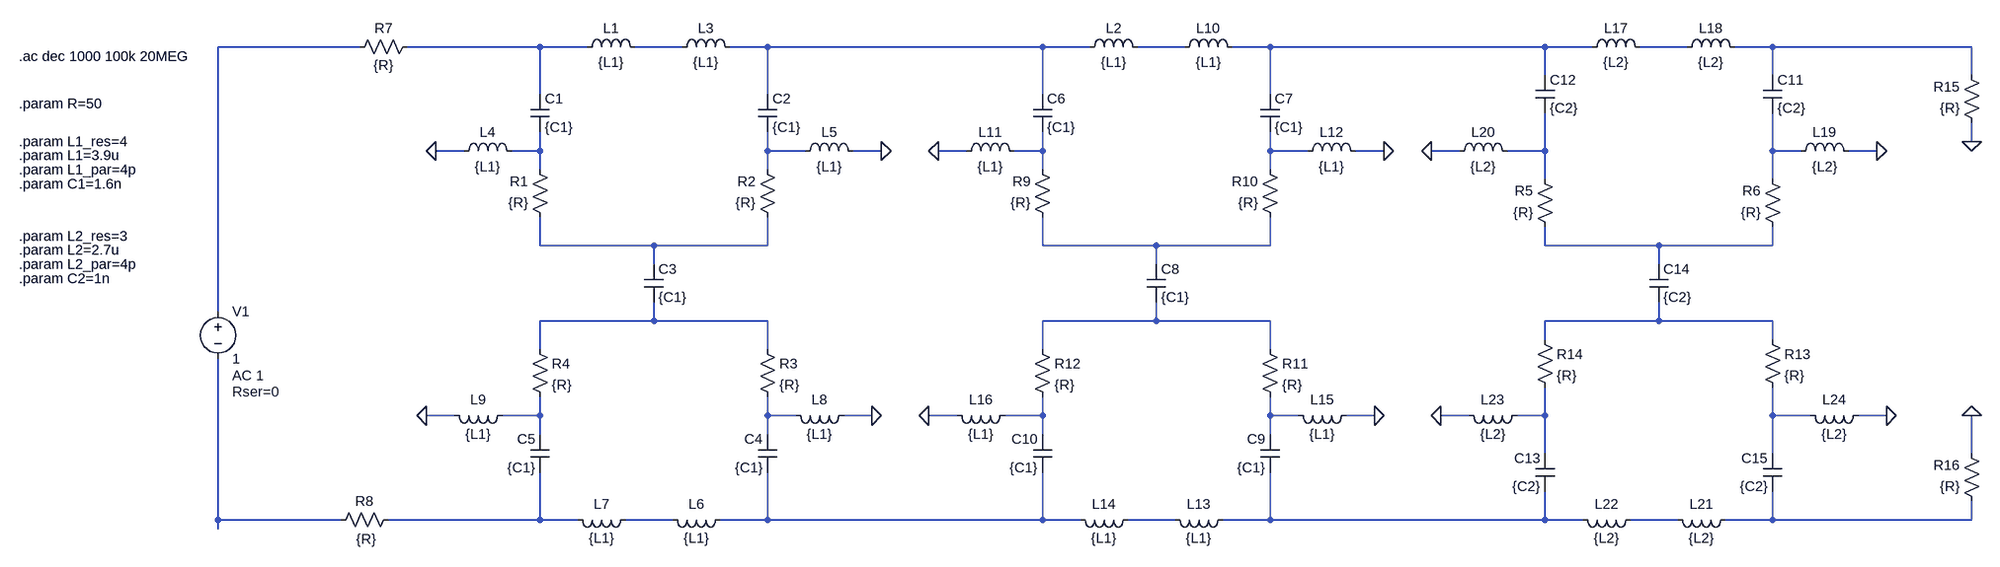
[diagram p0: schematic 1MHz_diff_filtre_reflectionless.asc]
1MHz_diff_filtre_reflectionless.asc, the LTspice schematic file:
Version 4
SHEET 1 4020 1216
WIRE 592 -32 336 -32
WIRE 896 -32 672 -32
WIRE 976 -32 896 -32
WIRE 1136 -32 1056 -32
WIRE 1280 -32 1216 -32
WIRE 1744 -32 1280 -32
WIRE 1824 -32 1744 -32
WIRE 1984 -32 1904 -32
WIRE 2128 -32 2064 -32
WIRE 2592 -32 2128 -32
WIRE 2672 -32 2592 -32
WIRE 2832 -32 2752 -32
WIRE 2976 -32 2912 -32
WIRE 3312 -32 2976 -32
WIRE 2592 16 2592 -32
WIRE 2976 16 2976 -32
WIRE 3312 16 3312 -32
WIRE 896 48 896 -32
WIRE 1280 48 1280 -32
WIRE 1744 48 1744 -32
WIRE 2128 48 2128 -32
WIRE 3312 128 3312 96
WIRE 768 144 720 144
WIRE 896 144 896 112
WIRE 896 144 848 144
WIRE 1280 144 1280 112
WIRE 1344 144 1280 144
WIRE 1472 144 1424 144
WIRE 1616 144 1568 144
WIRE 1744 144 1744 112
WIRE 1744 144 1696 144
WIRE 2128 144 2128 112
WIRE 2192 144 2128 144
WIRE 2320 144 2272 144
WIRE 2448 144 2400 144
WIRE 2592 144 2592 80
WIRE 2592 144 2528 144
WIRE 2976 144 2976 80
WIRE 3024 144 2976 144
WIRE 3152 144 3104 144
WIRE 896 176 896 144
WIRE 1280 176 1280 144
WIRE 1744 176 1744 144
WIRE 2128 176 2128 144
WIRE 2592 192 2592 144
WIRE 2976 192 2976 144
WIRE 896 304 896 256
WIRE 1088 304 896 304
WIRE 1280 304 1280 256
WIRE 1280 304 1088 304
WIRE 1744 304 1744 256
WIRE 1936 304 1744 304
WIRE 2128 304 2128 256
WIRE 2128 304 1936 304
WIRE 2592 304 2592 272
WIRE 2784 304 2592 304
WIRE 2976 304 2976 272
WIRE 2976 304 2784 304
WIRE 1088 336 1088 304
WIRE 1936 336 1936 304
WIRE 2784 336 2784 304
WIRE 336 416 336 -32
WIRE 1088 432 1088 400
WIRE 1088 432 896 432
WIRE 1280 432 1088 432
WIRE 1936 432 1936 400
WIRE 1936 432 1744 432
WIRE 2128 432 1936 432
WIRE 2784 432 2784 400
WIRE 2784 432 2592 432
WIRE 2976 432 2784 432
WIRE 2592 464 2592 432
WIRE 2976 464 2976 432
WIRE 896 480 896 432
WIRE 1280 480 1280 432
WIRE 1744 480 1744 432
WIRE 2128 480 2128 432
WIRE 752 592 704 592
WIRE 896 592 896 560
WIRE 896 592 832 592
WIRE 1280 592 1280 560
WIRE 1328 592 1280 592
WIRE 1456 592 1408 592
WIRE 1600 592 1552 592
WIRE 1744 592 1744 560
WIRE 1744 592 1680 592
WIRE 2128 592 2128 560
WIRE 2176 592 2128 592
WIRE 2304 592 2256 592
WIRE 2464 592 2416 592
WIRE 2592 592 2592 544
WIRE 2592 592 2544 592
WIRE 2976 592 2976 544
WIRE 3040 592 2976 592
WIRE 3168 592 3120 592
WIRE 896 624 896 592
WIRE 1280 624 1280 592
WIRE 1744 624 1744 592
WIRE 2128 624 2128 592
WIRE 2592 656 2592 592
WIRE 2976 656 2976 592
WIRE 3312 656 3312 592
WIRE 336 768 336 496
WIRE 560 768 336 768
WIRE 896 768 896 688
WIRE 896 768 640 768
WIRE 960 768 896 768
WIRE 1120 768 1040 768
WIRE 1280 768 1280 688
WIRE 1280 768 1200 768
WIRE 1744 768 1744 688
WIRE 1744 768 1280 768
WIRE 1808 768 1744 768
WIRE 1968 768 1888 768
WIRE 2128 768 2128 688
WIRE 2128 768 2048 768
WIRE 2592 768 2592 720
WIRE 2592 768 2128 768
WIRE 2656 768 2592 768
WIRE 2816 768 2736 768
WIRE 2976 768 2976 720
WIRE 2976 768 2896 768
WIRE 3312 768 3312 736
WIRE 3312 768 2976 768
WIRE 336 784 336 768
FLAG 720 144 0
FLAG 1472 144 0
FLAG 1456 592 0
FLAG 704 592 0
FLAG 1568 144 0
FLAG 2320 144 0
FLAG 2304 592 0
FLAG 1552 592 0
FLAG 2400 144 0
FLAG 3152 144 0
FLAG 3168 592 0
FLAG 2416 592 0
FLAG 3312 592 0
FLAG 3312 128 0
SYMBOL voltage 336 400 R0
WINDOW 123 24 124 Left 2
WINDOW 39 24 152 Left 2
SYMATTR Value2 AC 1
SYMATTR SpiceLine Rser=0
SYMATTR InstName V1
SYMATTR Value 1
SYMBOL res 688 -48 R90
WINDOW 0 0 56 VBottom 2
WINDOW 3 32 56 VTop 2
SYMATTR InstName R7
SYMATTR Value {R}
SYMBOL res 656 752 R90
WINDOW 0 0 56 VBottom 2
WINDOW 3 33 53 VTop 2
SYMATTR InstName R8
SYMATTR Value {R}
SYMBOL ind 960 -16 R270
WINDOW 0 32 56 VTop 2
WINDOW 3 5 56 VBottom 2
SYMATTR InstName L1
SYMATTR Value {L1}
SYMATTR SpiceLine Rser={L1_res} Cpar={L1_par}
SYMBOL cap 880 48 R0
SYMATTR InstName C1
SYMATTR Value {C1}
SYMBOL ind 1120 -16 R270
WINDOW 0 32 56 VTop 2
WINDOW 3 5 56 VBottom 2
SYMATTR InstName L3
SYMATTR Value {L1}
SYMATTR SpiceLine Rser={L1_res} Cpar={L1_par}
SYMBOL cap 1264 48 R0
SYMATTR InstName C2
SYMATTR Value {C1}
SYMBOL res 912 272 R180
WINDOW 0 36 76 Left 2
WINDOW 3 36 40 Left 2
SYMATTR InstName R1
SYMATTR Value {R}
SYMBOL res 1296 272 R180
WINDOW 0 36 76 Left 2
WINDOW 3 36 40 Left 2
SYMATTR InstName R2
SYMATTR Value {R}
SYMBOL ind 752 160 R270
WINDOW 0 32 56 VTop 2
WINDOW 3 5 56 VBottom 2
SYMATTR InstName L4
SYMATTR Value {L1}
SYMATTR SpiceLine Rser={L1_res} Cpar={L1_par}
SYMBOL ind 1328 160 R270
WINDOW 0 32 56 VTop 2
WINDOW 3 5 56 VBottom 2
SYMATTR InstName L5
SYMATTR Value {L1}
SYMATTR SpiceLine Rser={L1_res} Cpar={L1_par}
SYMBOL cap 1072 336 R0
SYMATTR InstName C3
SYMATTR Value {C1}
SYMBOL ind 1216 752 R90
WINDOW 0 5 56 VBottom 2
WINDOW 3 32 56 VTop 2
SYMATTR InstName L6
SYMATTR Value {L1}
SYMATTR SpiceLine Rser={L1_res} Cpar={L1_par}
SYMBOL cap 1296 688 R180
WINDOW 0 24 56 Left 2
WINDOW 3 24 8 Left 2
SYMATTR InstName C4
SYMATTR Value {C1}
SYMBOL ind 1056 752 R90
WINDOW 0 5 56 VBottom 2
WINDOW 3 32 56 VTop 2
SYMATTR InstName L7
SYMATTR Value {L1}
SYMATTR SpiceLine Rser={L1_res} Cpar={L1_par}
SYMBOL cap 912 688 R180
WINDOW 0 24 56 Left 2
WINDOW 3 24 8 Left 2
SYMATTR InstName C5
SYMATTR Value {C1}
SYMBOL res 1264 464 R0
SYMATTR InstName R3
SYMATTR Value {R}
SYMBOL res 880 464 R0
SYMATTR InstName R4
SYMATTR Value {R}
SYMBOL ind 1424 576 R90
WINDOW 0 5 56 VBottom 2
WINDOW 3 32 56 VTop 2
SYMATTR InstName L8
SYMATTR Value {L1}
SYMATTR SpiceLine Rser={L1_res} Cpar={L1_par}
SYMBOL ind 848 576 R90
WINDOW 0 5 56 VBottom 2
WINDOW 3 32 56 VTop 2
SYMATTR InstName L9
SYMATTR Value {L1}
SYMATTR SpiceLine Rser={L1_res} Cpar={L1_par}
SYMBOL ind 1808 -16 R270
WINDOW 0 32 56 VTop 2
WINDOW 3 5 56 VBottom 2
SYMATTR InstName L2
SYMATTR Value {L1}
SYMATTR SpiceLine Rser={L1_res} Cpar={L1_par}
SYMBOL cap 1728 48 R0
SYMATTR InstName C6
SYMATTR Value {C1}
SYMBOL ind 1968 -16 R270
WINDOW 0 32 56 VTop 2
WINDOW 3 5 56 VBottom 2
SYMATTR InstName L10
SYMATTR Value {L1}
SYMATTR SpiceLine Rser={L1_res} Cpar={L1_par}
SYMBOL cap 2112 48 R0
SYMATTR InstName C7
SYMATTR Value {C1}
SYMBOL res 1760 272 R180
WINDOW 0 36 76 Left 2
WINDOW 3 36 40 Left 2
SYMATTR InstName R9
SYMATTR Value {R}
SYMBOL res 2144 272 R180
WINDOW 0 36 76 Left 2
WINDOW 3 36 40 Left 2
SYMATTR InstName R10
SYMATTR Value {R}
SYMBOL ind 1600 160 R270
WINDOW 0 32 56 VTop 2
WINDOW 3 5 56 VBottom 2
SYMATTR InstName L11
SYMATTR Value {L1}
SYMATTR SpiceLine Rser={L1_res} Cpar={L1_par}
SYMBOL ind 2176 160 R270
WINDOW 0 32 56 VTop 2
WINDOW 3 5 56 VBottom 2
SYMATTR InstName L12
SYMATTR Value {L1}
SYMATTR SpiceLine Rser={L1_res} Cpar={L1_par}
SYMBOL cap 1920 336 R0
SYMATTR InstName C8
SYMATTR Value {C1}
SYMBOL ind 2064 752 R90
WINDOW 0 5 56 VBottom 2
WINDOW 3 32 56 VTop 2
SYMATTR InstName L13
SYMATTR Value {L1}
SYMATTR SpiceLine Rser={L1_res} Cpar={L1_par}
SYMBOL cap 2144 688 R180
WINDOW 0 24 56 Left 2
WINDOW 3 24 8 Left 2
SYMATTR InstName C9
SYMATTR Value {C1}
SYMBOL ind 1904 752 R90
WINDOW 0 5 56 VBottom 2
WINDOW 3 32 56 VTop 2
SYMATTR InstName L14
SYMATTR Value {L1}
SYMATTR SpiceLine Rser={L1_res} Cpar={L1_par}
SYMBOL cap 1760 688 R180
WINDOW 0 24 56 Left 2
WINDOW 3 24 8 Left 2
SYMATTR InstName C10
SYMATTR Value {C1}
SYMBOL res 2112 464 R0
SYMATTR InstName R11
SYMATTR Value {R}
SYMBOL res 1728 464 R0
SYMATTR InstName R12
SYMATTR Value {R}
SYMBOL ind 2272 576 R90
WINDOW 0 5 56 VBottom 2
WINDOW 3 32 56 VTop 2
SYMATTR InstName L15
SYMATTR Value {L1}
SYMATTR SpiceLine Rser={L1_res} Cpar={L1_par}
SYMBOL ind 1696 576 R90
WINDOW 0 5 56 VBottom 2
WINDOW 3 32 56 VTop 2
SYMATTR InstName L16
SYMATTR Value {L1}
SYMATTR SpiceLine Rser={L1_res} Cpar={L1_par}
SYMBOL ind 2656 -16 R270
WINDOW 0 32 56 VTop 2
WINDOW 3 5 56 VBottom 2
SYMATTR InstName L17
SYMATTR Value {L2}
SYMATTR SpiceLine Rser={L2_res} Cpar={L2_par}
SYMBOL ind 2816 -16 R270
WINDOW 0 32 56 VTop 2
WINDOW 3 5 56 VBottom 2
SYMATTR InstName L18
SYMATTR Value {L2}
SYMATTR SpiceLine Rser={L2_res} Cpar={L2_par}
SYMBOL cap 2960 16 R0
SYMATTR InstName C11
SYMATTR Value {C2}
SYMBOL cap 2576 16 R0
SYMATTR InstName C12
SYMATTR Value {C2}
SYMBOL ind 3008 160 R270
WINDOW 0 32 56 VTop 2
WINDOW 3 5 56 VBottom 2
SYMATTR InstName L19
SYMATTR Value {L2}
SYMATTR SpiceLine Rser={L2_res} Cpar={L2_par}
SYMBOL ind 2432 160 R270
WINDOW 0 32 56 VTop 2
WINDOW 3 5 56 VBottom 2
SYMATTR InstName L20
SYMATTR Value {L2}
SYMATTR SpiceLine Rser={L2_res} Cpar={L2_par}
SYMBOL res 2608 288 R180
WINDOW 0 36 76 Left 2
WINDOW 3 36 40 Left 2
SYMATTR InstName R5
SYMATTR Value {R}
SYMBOL res 2992 288 R180
WINDOW 0 36 76 Left 2
WINDOW 3 36 40 Left 2
SYMATTR InstName R6
SYMATTR Value {R}
SYMBOL cap 2768 336 R0
SYMATTR InstName C14
SYMATTR Value {C2}
SYMBOL ind 2912 752 R90
WINDOW 0 5 56 VBottom 2
WINDOW 3 32 56 VTop 2
SYMATTR InstName L21
SYMATTR Value {L2}
SYMATTR SpiceLine Rser={L2_res} Cpar={L2_par}
SYMBOL ind 2752 752 R90
WINDOW 0 5 56 VBottom 2
WINDOW 3 32 56 VTop 2
SYMATTR InstName L22
SYMATTR Value {L2}
SYMATTR SpiceLine Rser={L2_res} Cpar={L2_par}
SYMBOL cap 2608 720 R180
WINDOW 0 24 56 Left 2
WINDOW 3 24 8 Left 2
SYMATTR InstName C13
SYMATTR Value {C2}
SYMBOL cap 2992 720 R180
WINDOW 0 24 56 Left 2
WINDOW 3 24 8 Left 2
SYMATTR InstName C15
SYMATTR Value {C2}
SYMBOL ind 2560 576 R90
WINDOW 0 5 56 VBottom 2
WINDOW 3 32 56 VTop 2
SYMATTR InstName L23
SYMATTR Value {L2}
SYMATTR SpiceLine Rser={L2_res} Cpar={L2_par}
SYMBOL ind 3136 576 R90
WINDOW 0 5 56 VBottom 2
WINDOW 3 32 56 VTop 2
SYMATTR InstName L24
SYMATTR Value {L2}
SYMATTR SpiceLine Rser={L2_res} Cpar={L2_par}
SYMBOL res 2960 448 R0
SYMATTR InstName R13
SYMATTR Value {R}
SYMBOL res 2576 448 R0
SYMATTR InstName R14
SYMATTR Value {R}
SYMBOL res 3328 112 R180
WINDOW 0 36 76 Left 2
WINDOW 3 36 40 Left 2
SYMATTR InstName R15
SYMATTR Value {R}
SYMBOL res 3328 752 R180
WINDOW 0 36 76 Left 2
WINDOW 3 36 40 Left 2
SYMATTR InstName R16
SYMATTR Value {R}
TEXT 0 -16 Left 2 !.ac dec 1000 100k 20MEG
TEXT 0 200 Left 2 !.param C1=1.6n
TEXT 0 152 Left 2 !.param L1=3.9u
TEXT 0 128 Left 2 !.param L1_res=4
TEXT 0 176 Left 2 !.param L1_par=4p
TEXT 0 64 Left 2 !.param R=50
TEXT 0 360 Left 2 !.param C2=1n
TEXT 0 312 Left 2 !.param L2=2.7u
TEXT 0 288 Left 2 !.param L2_res=3
TEXT 0 336 Left 2 !.param L2_par=4p

The netlist it stands for:
* 1MHz_diff_filtre_reflectionless.asc
V1 N001 N027 1 AC 1 Rser=0
R7 N002 N001 {R}
R8 N028 N027 {R}
L1 N002 N003 {L1} Rser={L1_res} Cpar={L1_par}
C1 N002 N009 {C1}
L3 N003 N004 {L1} Rser={L1_res} Cpar={L1_par}
C2 N004 N010 {C1}
R1 N015 N009 {R}
R2 N015 N010 {R}
L4 0 N009 {L1} Rser={L1_res} Cpar={L1_par}
L5 N010 0 {L1} Rser={L1_res} Cpar={L1_par}
C3 N015 N018 {C1}
L6 N030 N029 {L1} Rser={L1_res} Cpar={L1_par}
C4 N030 N022 {C1}
L7 N029 N028 {L1} Rser={L1_res} Cpar={L1_par}
C5 N028 N021 {C1}
R3 N018 N022 {R}
R4 N018 N021 {R}
L8 0 N022 {L1} Rser={L1_res} Cpar={L1_par}
L9 N021 0 {L1} Rser={L1_res} Cpar={L1_par}
L2 N004 N005 {L1} Rser={L1_res} Cpar={L1_par}
C6 N004 N011 {C1}
L10 N005 N006 {L1} Rser={L1_res} Cpar={L1_par}
C7 N006 N012 {C1}
R9 N016 N011 {R}
R10 N016 N012 {R}
L11 0 N011 {L1} Rser={L1_res} Cpar={L1_par}
L12 N012 0 {L1} Rser={L1_res} Cpar={L1_par}
C8 N016 N019 {C1}
L13 N032 N031 {L1} Rser={L1_res} Cpar={L1_par}
C9 N032 N024 {C1}
L14 N031 N030 {L1} Rser={L1_res} Cpar={L1_par}
C10 N030 N023 {C1}
R11 N019 N024 {R}
R12 N019 N023 {R}
L15 0 N024 {L1} Rser={L1_res} Cpar={L1_par}
L16 N023 0 {L1} Rser={L1_res} Cpar={L1_par}
L17 N006 N007 {L2} Rser={L2_res} Cpar={L2_par}
L18 N007 N008 {L2} Rser={L2_res} Cpar={L2_par}
C11 N008 N014 {C2}
C12 N006 N013 {C2}
L19 N014 0 {L2} Rser={L2_res} Cpar={L2_par}
L20 0 N013 {L2} Rser={L2_res} Cpar={L2_par}
R5 N017 N013 {R}
R6 N017 N014 {R}
C14 N017 N020 {C2}
L21 N034 N033 {L2} Rser={L2_res} Cpar={L2_par}
L22 N033 N032 {L2} Rser={L2_res} Cpar={L2_par}
C13 N032 N025 {C2}
C15 N034 N026 {C2}
L23 N025 0 {L2} Rser={L2_res} Cpar={L2_par}
L24 0 N026 {L2} Rser={L2_res} Cpar={L2_par}
R13 N020 N026 {R}
R14 N020 N025 {R}
R15 0 N008 {R}
R16 N034 0 {R}
.ac dec 1000 100k 20MEG
.param C1=1.6n
.param L1=3.9u
.param L1_res=4
.param L1_par=4p
.param R=50
.param C2=1n
.param L2=2.7u
.param L2_res=3
.param L2_par=4p
.backanno
.end